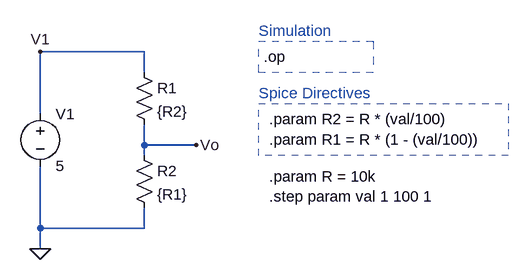
[diagram p0: schematic Variable_Resistor_2.asc]
Variable_Resistor_2.asc, the LTspice schematic file:
Version 4
SHEET 1 1432 696
WIRE 464 80 304 80
WIRE 464 112 464 80
WIRE 304 176 304 80
WIRE 464 224 464 192
WIRE 544 224 464 224
WIRE 464 240 464 224
WIRE 304 352 304 256
WIRE 464 352 464 320
WIRE 464 352 304 352
WIRE 304 384 304 352
FLAG 304 384 0
FLAG 544 224 Vo
FLAG 304 80 V1
SYMBOL res 448 96 R0
SYMATTR InstName R1
SYMATTR Value {R2}
SYMBOL res 448 224 R0
SYMATTR InstName R2
SYMATTR Value {R1}
SYMBOL voltage 304 160 R0
SYMATTR InstName V1
SYMATTR Value 5
TEXT 640 48 Left 2 ;Simulation
TEXT 656 184 Left 2 !.param R2 = R * (val/100)\n.param R1 = R * (1 - (val/100))
TEXT 648 88 Left 2 !.op
TEXT 640 144 Left 2 ;Spice Directives
TEXT 656 272 Left 2 !.param R = 10k\n.step param val 1 100 1
RECTANGLE Normal 816 112 640 64 2
RECTANGLE Normal 1024 240 640 160 2

The netlist it stands for:
* Variable_Resistor_2.asc
R1 V1 Vo {R2}
R2 Vo 0 {R1}
V1 V1 0 5
* Simulation
.param R2 = R * (val/100)
.param R1 = R * (1 - (val/100))
.op
* Spice Directives
.param R = 10k
.step param val 1 100 1
.backanno
.end